# EAGLE design BPW5037-7Segment_Wing-4 (EAGLE 5.11)
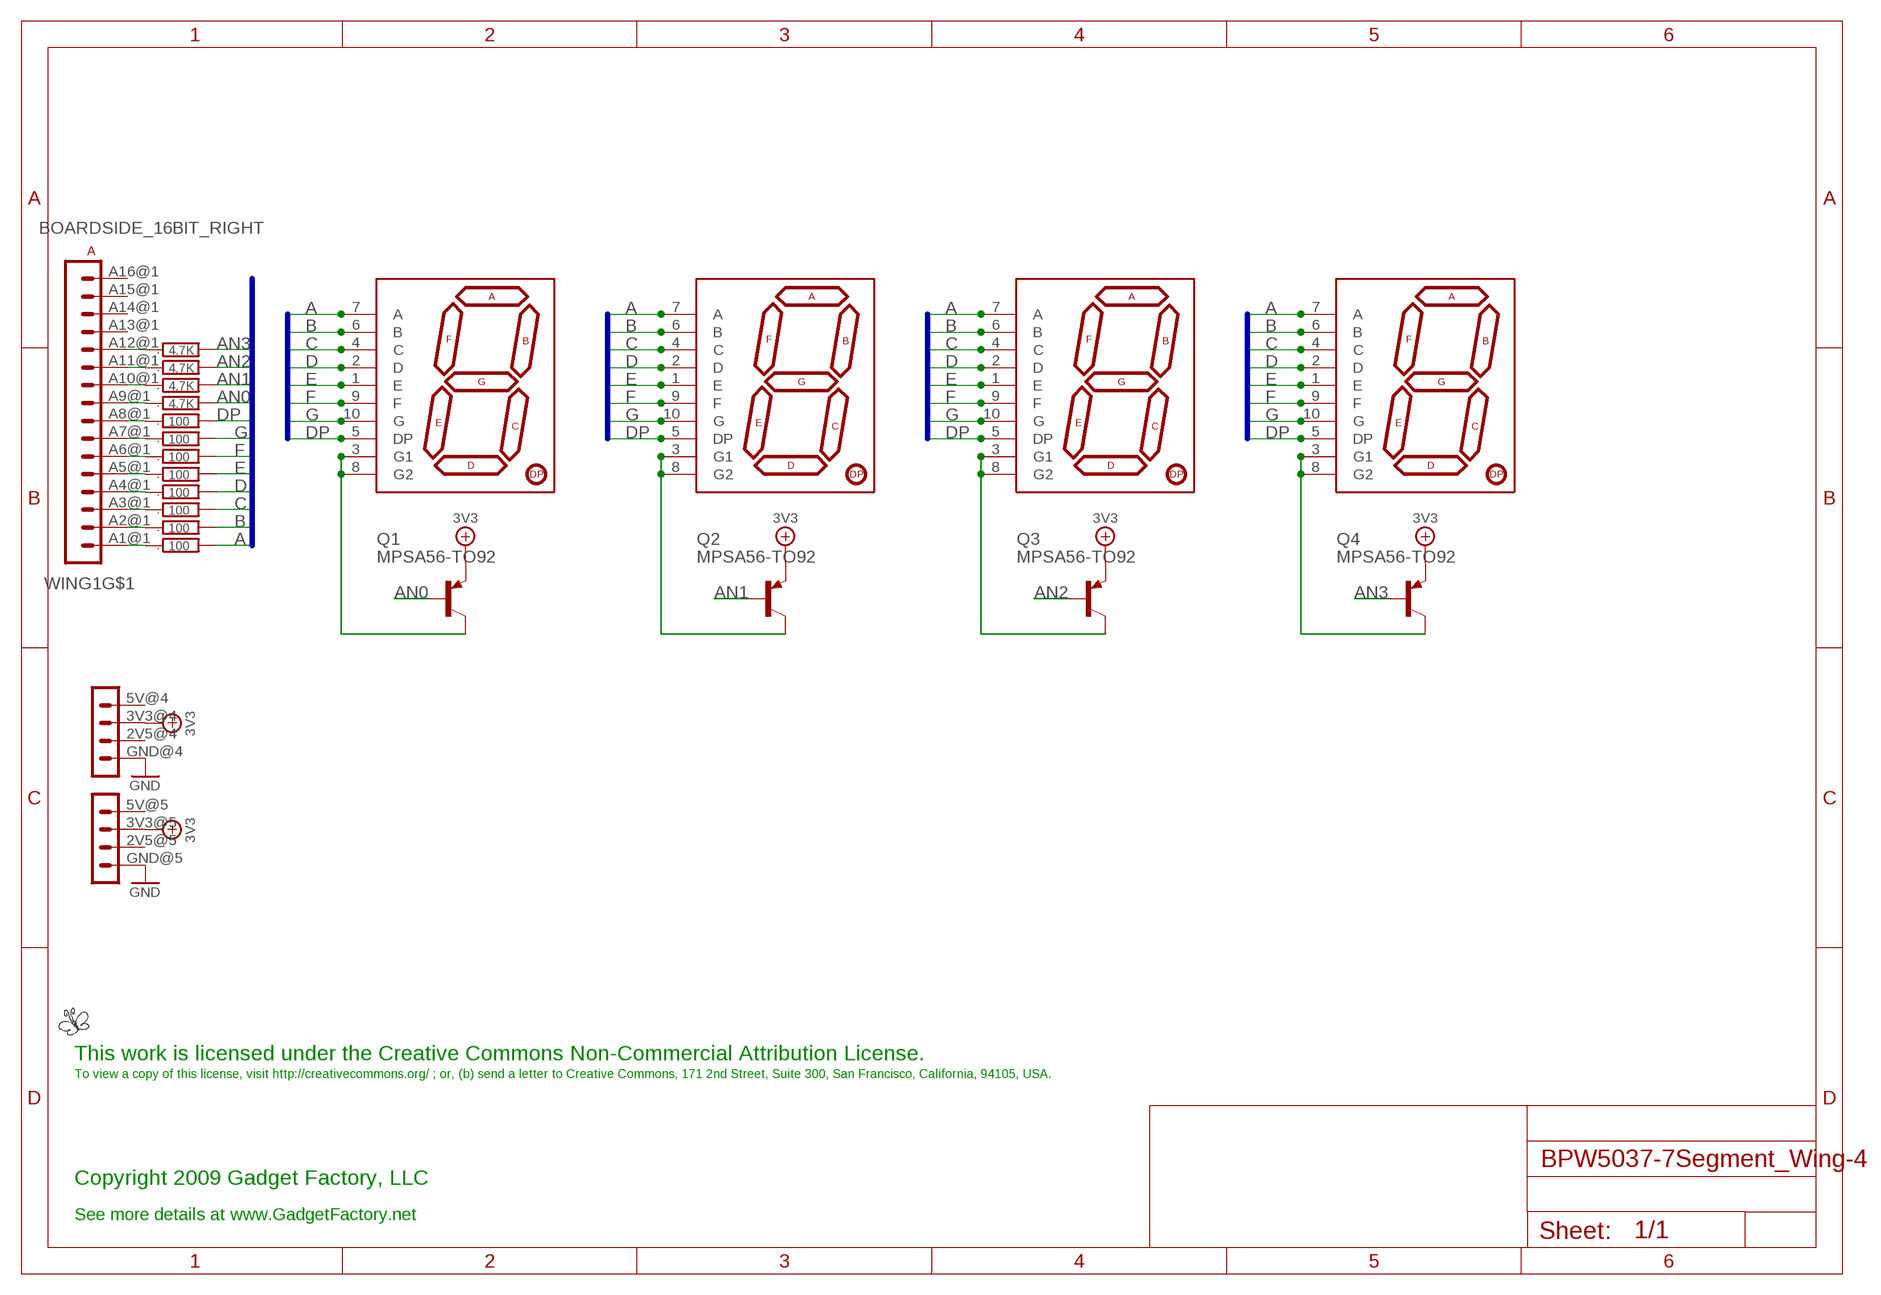
[diagram p0: schematic, sheet 1]

## Parts
LOGO1  BUTTERFLY_LOGO  [BUTTERFLY_LOGO]
Q1  MPSA56-TO92  [TO92-CBE]
Q2  MPSA56-TO92  [TO92-CBE]
Q3  MPSA56-TO92  [TO92-CBE]
Q4  MPSA56-TO92  [TO92-CBE]
R1  100  R  [DUALRESISTOR]
R2  100  R  [DUALRESISTOR]
R3  100  R  [DUALRESISTOR]
R4  100  R  [DUALRESISTOR]
R5  100  R  [DUALRESISTOR]
R6  100  R  [DUALRESISTOR]
R7  100  R  [DUALRESISTOR]
R8  100  R  [DUALRESISTOR]
R9  4.7K  R  [DUALRESISTOR]
R10  4.7K  R  [DUALRESISTOR]
R11  4.7K  R  [DUALRESISTOR]
R12  4.7K  R  [DUALRESISTOR]
SEG0  7-SEGMENT-DISPLAY-1"-RED  [7-SEGMENT-1"PTH]
SEG1  7-SEGMENT-DISPLAY-1"-RED  [7-SEGMENT-1"PTH]
SEG2  7-SEGMENT-DISPLAY-1"-RED  [7-SEGMENT-1"PTH]
SEG3  7-SEGMENT-DISPLAY-1"-RED  [7-SEGMENT-1"PTH]
WING1  BOARDSIDE_16BIT_RIGHT  [BOARDSIDE_16BIT_RIGHT]

## Nets
3V3: Q1.E Q2.E Q3.E Q4.E WING1.3V3@4(3V3) WING1.3V3@5(3V3)
A: R1.2 SEG0.7(A) SEG1.7(A) SEG2.7(A) SEG3.7(A)
AN0: Q1.B R9.2
AN1: Q2.B R10.2
AN2: Q3.B R11.2
AN3: Q4.B R12.2
B: R2.2 SEG0.6(B) SEG1.6(B) SEG2.6(B) SEG3.6(B)
C: R3.2 SEG0.4(C) SEG1.4(C) SEG2.4(C) SEG3.4(C)
D: R4.2 SEG0.2(D) SEG1.2(D) SEG2.2(D) SEG3.2(D)
DP: R8.2 SEG0.5(DP) SEG1.5(DP) SEG2.5(DP) SEG3.5(DP)
E: R5.2 SEG0.1(E) SEG1.1(E) SEG2.1(E) SEG3.1(E)
F: R6.2 SEG0.9(F) SEG1.9(F) SEG2.9(F) SEG3.9(F)
G: R7.2 SEG0.10(G) SEG1.10(G) SEG2.10(G) SEG3.10(G)
GND: WING1.GND@4(GND) WING1.GND@5(GND)
N$2: Q1.C SEG0.3(G1) SEG0.8(G2)
N$4: Q2.C SEG1.3(G1) SEG1.8(G2)
N$5: Q3.C SEG2.3(G1) SEG2.8(G2)
N$6: Q4.C SEG3.3(G1) SEG3.8(G2)
N$13: R1.1 WING1.A1@1(A1)
N$14: R2.1 WING1.A2@1(A2)
N$15: R3.1 WING1.A3@1(A3)
N$16: R4.1 WING1.A4@1(A4)
N$17: R5.1 WING1.A5@1(A5)
N$18: R6.1 WING1.A6@1(A6)
N$19: R7.1 WING1.A7@1(A7)
N$20: R8.1 WING1.A8@1(A8)
N$21: R9.1 WING1.A9@1(A9)
N$22: R10.1 WING1.A10@1(A10)
N$23: R11.1 WING1.A11@1(A11)
N$24: R12.1 WING1.A12@1(A12)
Unconnected: WING1.2V5@4(2V5) WING1.2V5@5(2V5) WING1.5V@4(5V) WING1.5V@5(5V) WING1.A13@1(A13) WING1.A14@1(A14) WING1.A15@1(A15) WING1.A16@1(A16)

## Buses
A,B,C,D,E,F,G,DP
A,B,C,D,E,F,G,DP,AN0,AN1,AN2,AN3,AN4,AN5,AN6,AN7,AN8,AN9

## Notes on the sheet
- This work is licensed under the Creative Commons Non-Commercial Attribution License.
- To view a copy of this license, visit http://creativecommons.org/ ; or, (b) send a letter to Creative Commons, 171 2nd Street, Suite 300, San Francisco, California, 94105, USA.
- Copyright 2009 Gadget Factory, LLC
- See more details at www.GadgetFactory.net

## Library data of the parts
LOGO1 = GadgetFactory_Pub:BUTTERFLY_LOGO
Q1-Q4 = transistor-pnp:*-?: PNP Transistor
R1-R12 = GadgetFactory:R: RESISTOR, European symbol
SEG0 SEG1-SEG3 = SparkFun:7-SEGMENT-DISPLAY-1"-RED: 7-Segment Display 1" Red (COM-08546)
WING1 = GadgetFactory_Pub:BOARDSIDE_16BIT_RIGHT

## Net classes
1 power: width 0.508 mm

## Board
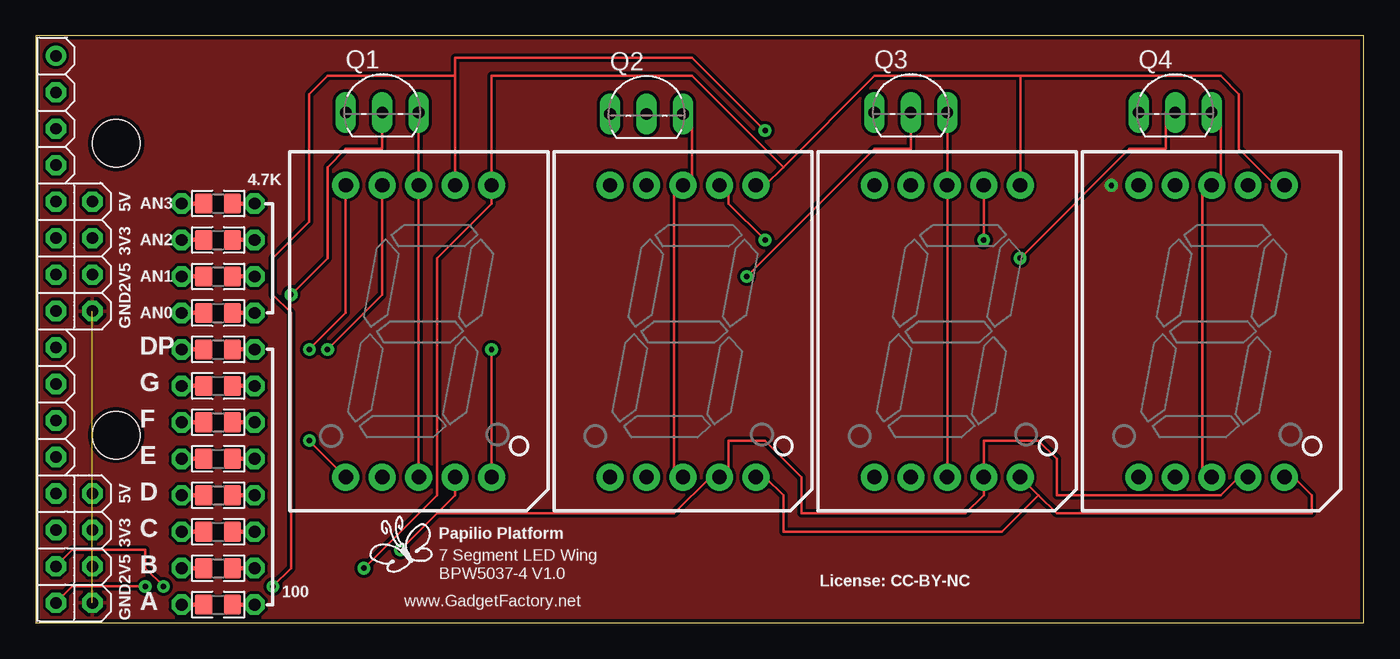
[diagram p1: board, top side]
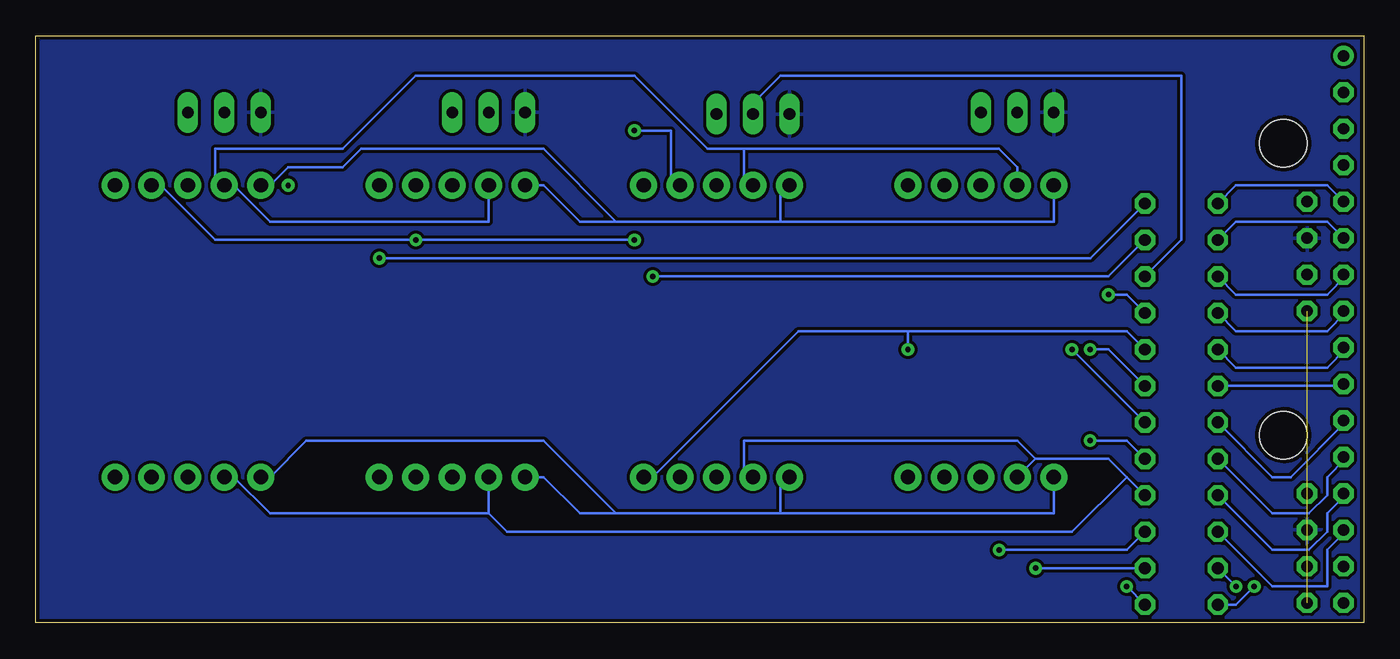
[diagram p2: board, bottom side, seen from below]

Size 92.51 x 40.88 mm. Coordinates in mm from the lower left corner, seen from the top.
Outline: 0,0 92.51,0 92.51,40.88 0,40.88 0,0
Copper layers (1*16): Top 0.035mm / dielectric 1.5mm / Bottom 0.035mm
Design rules "SparkFun_Derived_GoldePheonix_7mil": minimum track width 7mil, minimum drill 15mil, track to track 8mil, track to pad 8mil, pad to pad 8mil, via to via 8mil, smd to smd 8mil, copper to edge 10mil, drill to drill 8mil, minimum pad ring 12mil, minimum via ring 10mil, stop-mask expansion 4mil, vias tented up to drill 18mil, thermal gap 10mil

### Footprints (pad centres in the part's own frame; a part is rotated, then mirrored left to right if it is on the bottom)
TO92-CBE = drill 0.813 long: B 0,0; C 2.54,0; E -2.54,0
DUALRESISTOR = drill 0.813 octagon: 1 -2.543,0; 2 2.537,0 | smd 1.2 x 1.4: 3 -1,0; 4 1,0
7-SEGMENT-1"PTH = drill 1 pad 1.88 round: 1 -5.08,-10.16; 2 -2.54,-10.16; 3 0,-10.16; 4 2.54,-10.16; 5 5.08,-10.16; 6 5.08,10.16; 7 2.54,10.16; 8 0,10.16; 9 -2.54,10.16; 10 -5.08,10.16
BOARDSIDE_16BIT_RIGHT = drill 0.8 octagon: 2V5@4 3.81,-16.51; 2V5@5 3.81,3.81; 3V3@4 3.81,-13.97; 3V3@5 3.81,6.35; 5V@4 3.81,-11.43; 5V@5 3.81,8.89; A1@1 1.27,-19.05; A2@1 1.27,-16.51; A3@1 1.27,-13.97; A4@1 1.27,-11.43; A5@1 1.27,-8.89; A6@1 1.27,-6.35; A7@1 1.27,-3.81; A8@1 1.27,-1.27; A9@1 1.27,1.27; A10@1 1.27,3.81; A11@1 1.27,6.35; A12@1 1.27,8.89; A13@1 1.27,11.43; A14@1 1.27,13.97; A15@1 1.27,16.51; GND@4 3.81,-19.05; GND@5 3.81,1.27 | drill 0.8 round: A16@1 1.27,19.05 | hole 3.302: 5.461,12.954; 5.461,-7.366

### Placement (x,y rotation side)
LOGO1  25.53,4.95 0 top
Q1  24.13,35.56 0 top
Q2  42.55,35.43 0 top
Q3  60.96,35.56 0 top
Q4  79.38,35.56 0 top
R1  12.7,1.27 0 top
R2  12.7,3.81 0 top
R3  12.7,6.35 0 top
R4  12.7,8.89 0 top
R5  12.7,11.43 0 top
R6  12.7,13.97 0 top
R7  12.7,16.51 0 top
R8  12.7,19.05 0 top
R9  12.7,21.59 0 top
R10  12.7,24.13 0 top
R11  12.7,26.67 0 top
R12  12.7,29.21 0 top
SEG0  26.67,20.32 0 top
SEG1  45.09,20.32 0 top
SEG2  63.5,20.32 0 top
SEG3  81.92,20.32 0 top
WING1  0.13,20.45 0 top

### Tracks (layer width: path | path; a pad name or v marks a point on that pad's centre or on a via)
3V3
  pour Bottom: 0.13,40.77 92.33,40.77 92.33,0.13 0.13,0.13
A  (via drill 0.38)
  Top 0.178: v66.04,26.67 SEG2.7 | v16.51,2.54 17.78,3.81 17.78,21.59 16.51,22.86 16.51,25.4 19.05,27.94 19.05,36.83 20.32,38.1 29.21,38.1 | 29.21,38.1 SEG0.7 | v50.8,34.29 45.72,39.37 29.21,39.37 29.21,38.1 | v50.8,26.67 48.26,29.21 48.26,30.48 SEG1.7
  Bottom 0.178: SEG3.7 83.82,30.48 80.01,26.67 v66.04,26.67 v50.8,26.67 | v16.51,2.54 R1.2 | v50.8,34.29 48.26,34.29 48.26,30.48 SEG1.7
AN0  (via drill 0.38)
  Top 0.178: v17.78,22.86 20.32,25.4 20.32,31.75 21.59,33.02 24.13,33.02 Q1.B
  Bottom 0.178: v17.78,22.86 16.51,22.86 R9.2
AN1
  Bottom 0.178: R10.2 12.7,26.67 12.7,38.1 40.64,38.1 43.18,35.56 Q2.B
AN2  (via drill 0.38)
  Top 0.178: v49.53,24.13 58.42,33.02 60.96,33.02 Q3.B
  Bottom 0.178: v49.53,24.13 17.78,24.13 R11.2
AN3  (via drill 0.38)
  Top 0.178: v68.58,25.4 76.2,33.02 78.74,33.02 78.74,35.56 Q4.B
  Bottom 0.178: v68.58,25.4 19.05,25.4 R12.2
B  (via drill 0.38)
  Top 0.178: 52.07,31.75 58.42,38.1 68.58,38.1 | 52.07,31.75 50.8,30.48 SEG1.6 | 68.58,38.1 SEG2.6 | 68.58,38.1 82.55,38.1 83.82,36.83 83.82,33.02 86.36,30.48 SEG3.6 | v22.86,3.81 27.94,8.89 27.94,25.4 31.75,29.21 SEG0.6 31.75,38.1 45.72,38.1 52.07,31.75
  Bottom 0.178: R2.2 v22.86,3.81
C  (via drill 0.38)
  Top 0.178: 27.94,7.62 29.21,8.89 SEG0.4 | v25.4,5.08 27.94,7.62 | 27.94,7.62 44.45,7.62 46.99,10.16 SEG1.4 48.26,10.16 48.26,12.7 50.8,12.7 53.34,10.16 53.34,7.62 64.77,7.62 66.04,8.89 SEG2.4 66.04,12.7 69.85,12.7 71.12,11.43 71.12,8.89 82.55,8.89 83.82,10.16 SEG3.4
  Bottom 0.178: v25.4,5.08 16.51,5.08 R3.2
D
  Bottom 0.178: 60.96,7.62 SEG2.2 | 60.96,7.62 76.2,7.62 78.74,10.16 SEG3.2 | 16.51,10.16 17.78,11.43 22.86,11.43 | 16.51,10.16 R4.2 | 22.86,11.43 SEG0.2 | 22.86,11.43 24.13,12.7 43.18,12.7 43.18,10.16 SEG1.2 | 60.96,7.62 59.69,6.35 20.32,6.35 16.51,10.16
DP  (via drill 0.38)
  Top 0.178: 69.85,8.89 71.12,7.62 88.9,7.62 88.9,8.89 87.63,10.16 SEG3.5 | 69.85,8.89 SEG2.5 | v31.75,19.05 SEG0.5 | 69.85,8.89 67.31,6.35 52.07,6.35 52.07,8.89 50.8,10.16 SEG1.5
  Bottom 0.178: 31.75,20.32 39.37,20.32 49.53,10.16 SEG1.5 | 31.75,20.32 16.51,20.32 R8.2 | 31.75,20.32 v31.75,19.05
E  (via drill 0.38)
  Top 0.178: v19.05,12.7 SEG0.1
  Bottom 0.178: v19.05,12.7 16.51,12.7 R5.2 | 40.64,7.62 40.64,10.16 SEG1.1 | 52.07,7.62 54.61,7.62 57.15,10.16 SEG2.1 | 40.64,7.62 52.07,7.62 | 52.07,7.62 57.15,12.7 73.66,12.7 76.2,10.16 SEG3.1 | SEG0.1 21.59,7.62 40.64,7.62
F  (via drill 0.38)
  Top 0.178: v20.32,19.05 24.13,22.86 SEG0.9
  Bottom 0.178: SEG2.9 60.96,27.94 76.2,27.94 78.74,30.48 SEG3.9 80.01,30.48 80.01,33.02 71.12,33.02 66.04,38.1 50.8,38.1 45.72,33.02 43.18,33.02 | v20.32,19.05 R6.2 | 43.18,33.02 43.18,30.48 SEG1.9 | 43.18,33.02 25.4,33.02 24.13,31.75 SEG0.9
G  (via drill 0.38)
  Top 0.178: v19.05,19.05 21.59,21.59 SEG0.10
  Bottom 0.178: v19.05,19.05 17.78,19.05 R7.2 | 40.64,27.94 40.64,30.48 SEG1.10 | 52.07,27.94 54.61,27.94 57.15,30.48 SEG2.10 | 40.64,27.94 52.07,27.94 | 52.07,27.94 57.15,33.02 69.85,33.02 71.12,31.75 74.93,31.75 76.2,30.48 SEG3.10 | SEG0.10 21.59,27.94 40.64,27.94
GND  (via drill 0.38)  (1 unrouted)
  other vias: 74.93,30.48
  pour Top: 0.13,40.77 92.33,40.77 92.33,0.13 0.13,0.13
N$2
  Top 0.178: Q1.C SEG0.8 SEG0.3
N$4
  Top 0.178: Q2.C 45.72,35.56 45.72,30.48 SEG1.8 44.45,30.48 44.45,10.16 SEG1.3
N$5
  Top 0.178: Q3.C SEG2.8 SEG2.3
N$6
  Top 0.178: Q4.C 82.55,35.56 82.55,30.48 SEG3.8 81.28,30.48 81.28,10.16 SEG3.3
N$13  (via drill 0.38)
  Top 0.178: v7.62,2.54 2.54,2.54 WING1.A1@1 1.27,1.27
  Bottom 0.178: v7.62,2.54 8.89,1.27 R1.1
N$14  (via drill 0.38)
  Top 0.178: v8.89,2.54 7.62,3.81 7.62,5.08 2.54,5.08 WING1.A2@1 1.27,3.81
  Bottom 0.178: v8.89,2.54 R2.1
N$15
  Bottom 0.178: WING1.A3@1 1.27,6.35 2.54,5.08 2.54,2.54 6.35,2.54 R3.1
N$16
  Bottom 0.178: WING1.A4@1 1.27,8.89 2.54,7.62 2.54,6.35 3.81,5.08 6.35,5.08 R4.1
N$17
  Bottom 0.178: WING1.A5@1 1.27,11.43 2.54,10.16 2.54,8.89 3.81,7.62 6.35,7.62 R5.1
N$18
  Bottom 0.178: WING1.A6@1 1.27,13.97 5.08,10.16 6.35,10.16 R6.1
N$19
  Bottom 0.178: WING1.A7@1 1.27,16.51 R7.1
N$20
  Bottom 0.178: WING1.A8@1 1.27,19.05 2.54,17.78 8.89,17.78 R8.1
N$21
  Bottom 0.178: WING1.A9@1 1.27,21.59 2.54,20.32 8.89,20.32 R9.1
N$22
  Bottom 0.178: WING1.A10@1 1.27,24.13 2.54,22.86 8.89,22.86 R10.1
N$23
  Bottom 0.178: 1.27,26.67 WING1.A11@1 2.54,27.94 8.89,27.94 R11.1
N$24
  Bottom 0.178: 1.27,29.21 WING1.A12@1 2.54,30.48 8.89,30.48 R12.1

### Text on the board
tPlace: 4.7K | AN3 | AN2 | AN1 | AN0 | DP | G | F | E | D | C | Papilio Platform | B | 7 Segment LED Wing | BPW5037-4 V1.0 | License: CC-BY-NC | 100 | A | www.GadgetFactory.net